# Altium project IRF9540NS IRFZ44 P+N CHAN.PrjPcb
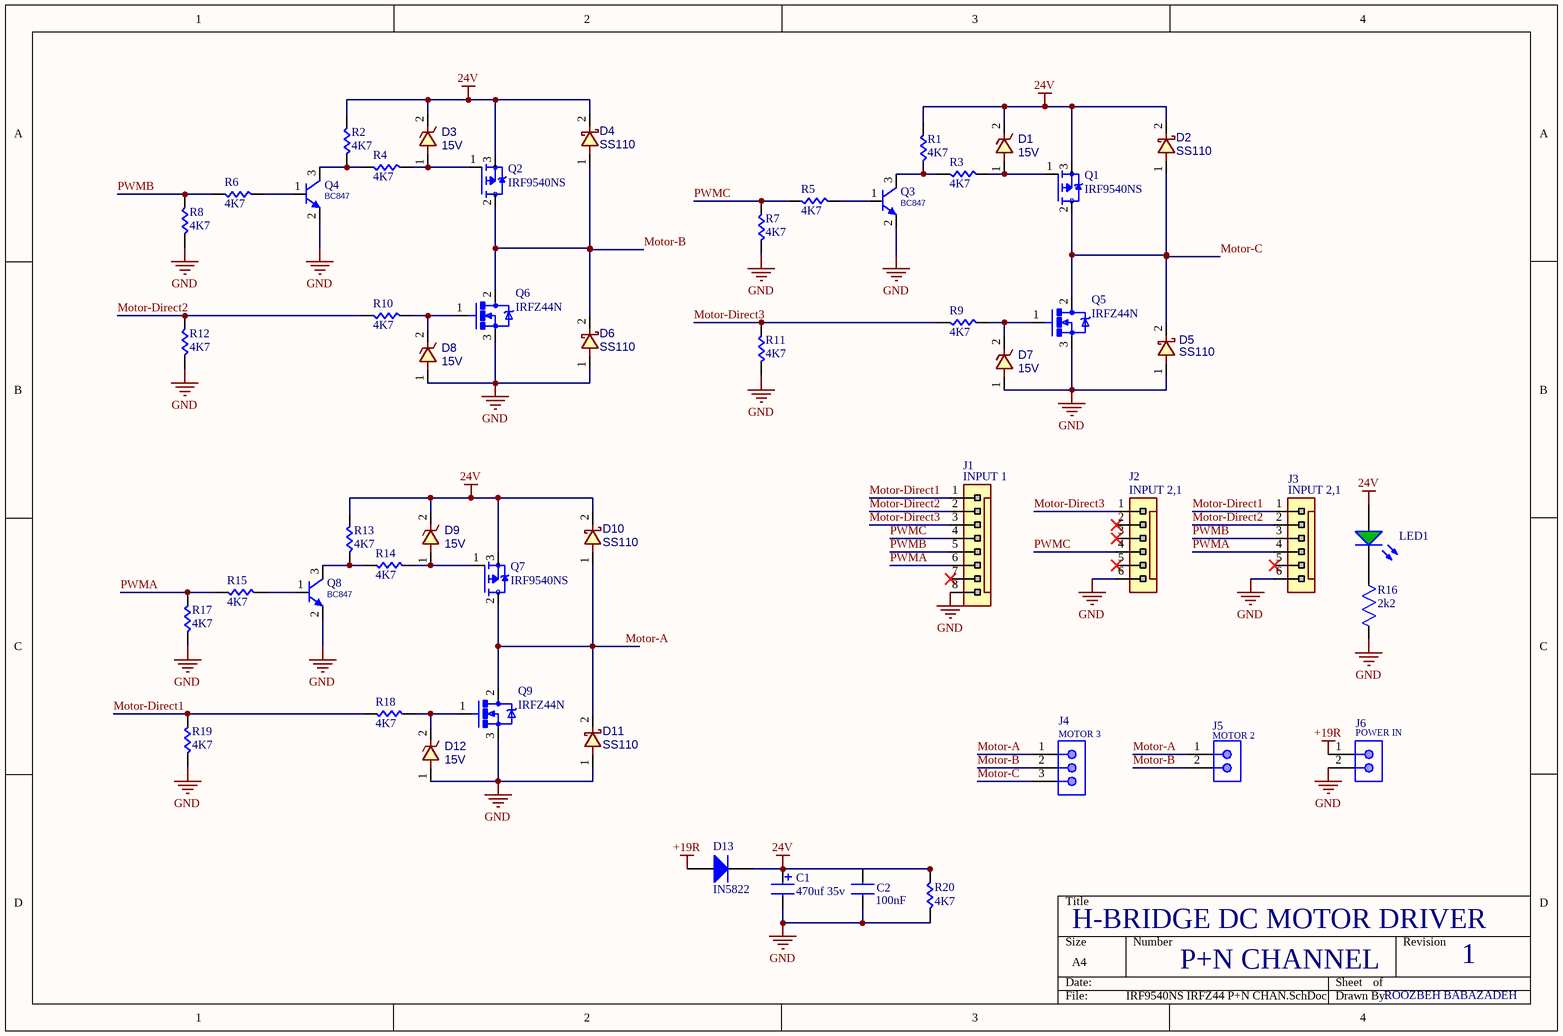
[diagram p0: IRF9540NS IRFZ44 P+N CHAN.SchDoc]
1 sheet, 51 parts. Net scope: global (net labels, ports and power ports of the same name join across sheets).
Board file: IRF9540NS IRFZ44 P+N CHAN.PcbDoc

## Sheet IRF9540NS IRFZ44 P+N CHAN.SchDoc
size A4

### Parts
C1  470uf 35v  [C_EL_10X12]
C2  100nF  [C0805E]
D1  15V  [D_AX02_DO35]
D2  SS110  [D_SMA]
D3  15V  [D_AX02_DO35]
D4  SS110  [D_SMA]
D5  SS110  [D_SMA]
D6  SS110  [D_SMA]
D7  15V  [D_AX02_DO35]
D8  15V  [D_AX02_DO35]
D9  15V  [D_AX02_DO35]
D10  SS110  [D_SMA]
D11  SS110  [D_SMA]
D12  15V  [D_AX02_DO35]
D13  IN5822  [D_AX06_DO27]
J1  INPUT 1  [WF_8]
J2  INPUT 2,1  [WF_6]
J3  INPUT 2,1  [WF_6]
J4  MOTOR 3  [PWL_3]
J5  MOTOR 2  [PWL_2]
J6  POWER IN  [PWL_2]
LED1  (no value)  [LED1206RED]
Q1  IRF9540NS  [DPAK2]
Q2  IRF9540NS  [DPAK2]
Q3  BC847  [SOT23]
Q4  BC847  [SOT23]
Q5  IRFZ44N  [DPAK2]
Q6  IRFZ44N  [DPAK2]
Q7  IRF9540NS  [DPAK2]
Q8  BC847  [SOT23]
Q9  IRFZ44N  [DPAK2]
R1  4K7  [R0805]
R2  4K7  [R0805]
R3  4K7  [R0805]
R4  4K7  [R0805]
R5  4K7  [R0805]
R6  4K7  [R0805]
R7  4K7  [R0805]
R8  4K7  [R0805]
R9  4K7  [R0805]
R10  4K7  [R0805]
R11  4K7  [R0805]
R12  4K7  [R0805]
R13  4K7  [R0805]
R14  4K7  [R0805]
R15  4K7  [R0805]
R16  2k2  [R0805]
R17  4K7  [R0805]
R18  4K7  [R0805]
R19  4K7  [R0805]
R20  4K7  [R0805]

### Nets
24V: C1.1 C2.2 D1.2 D2.2 D3.2 D4.2 D9.2 D10.2 D13.2(K) LED1.1(A) Q1.3 Q2.3 Q7.3 R1.1 R2.1 R13.1 R20.2
+19R: D13.1(A) J6.1
GND: C1.2 C2.1 D5.1 D6.1 D7.1 D8.1 D11.1 D12.1 J1.8 J2.6 J3.6 J6.2 Q3.2(E) Q4.2(E) Q5.3 Q6.3 Q8.2(E) Q9.3 R7.1 R8.1 R11.2 R12.2 R16.2 R17.1 R19.2 R20.1
Motor-A: D10.1 D11.2 J4.1 J5.1 Q7.2 Q9.2
Motor-B: D4.1 D6.2 J4.2 J5.2 Q2.2 Q6.2
Motor-C: D2.1 D5.2 J4.3 Q1.2 Q5.2
Motor-Direct1: J1.1 J3.1 R18.2 R19.1
Motor-Direct2: J1.2 J3.2 R10.2 R12.1
Motor-Direct3: J1.3 J2.1 R9.2 R11.1
PWMA: J1.6 J3.4 R15.1 R17.2
PWMB: J1.5 J3.3 R6.1 R8.2
PWMC: J1.4 J2.4 R5.1 R7.2
NetD1_1: D1.1 Q1.1 R3.1
NetD3_1: D3.1 Q2.1 R4.1
NetD7_2: D7.2 Q5.1 R9.1
NetD8_2: D8.2 Q6.1 R10.1
NetD9_1: D9.1 Q7.1 R14.1
NetD12_2: D12.2 Q9.1 R18.1
NetLED1_2: LED1.2(K) R16.1
NetQ3_1: Q3.1(B) R5.2
NetQ3_3: Q3.3(C) R1.2 R3.2
NetQ4_1: Q4.1(B) R6.2
NetQ4_3: Q4.3(C) R2.2 R4.2
NetQ8_1: Q8.1(B) R15.2
NetQ8_3: Q8.3(C) R13.2 R14.2

Not connected (* = marked no-connect by the designer): J1 7*; J2 2* 3* 5*; J3 5*

### Notes on the sheet
- H-BRIDGE DC MOTOR DRIVER
- P+N CHANNEL
- 1
- ROOZBEH BABAZADEH

### Library data of the parts
C1 = CAP3528
C2 = C
D1 D3 D7-D9 D12 = ZENER: DIODE, ZENER, 3W, 5.6V; MANF: MCC; DESC: DESCRIPTION; PARAM2: 0.5W, 2Ohm, 67mA, -55~150oC; MANF_P#: 3SMAJ5919B-TP; ASSEMBLY: ASSEMBLY; PRICE: 0.5$; PARAM: 5.6V
D2 D4-D6 D10 D11 = SCHOTTKY: DIODE, SCHOTTKY, 40V, 1A; MANF: DIODES; MANF_P#: 1N5819HW-7-F; DESC: DESCRIPTION; ASSEMBLY: ASSEMBLY; PRICE: PRICE; PARAM2: 1A; PARAM: 40V
  D2 D4 D6 D10 D11: VALUE: SS110
D13 = Diode 1N4005: 1 Amp General Purpose Rectifier; Published: 8-Jun-2000; LatestRevisionDate: 17-Jul-2002; LatestRevisionNote: Re-released for DXP Platform.; DatasheetVersion: 1998; PackageVersion: Aug-1999; PackageReference: DO-41; Publisher: Altium Limited; PackageDescription: Diode, Axial; Body 5.2 x 2.7 mm (LxDia. max), Lead Dia. 0.86 mm (max); Code_JEDEC: DO-204-AL; ComponentLink1Description: Manufacturer Link; ComponentLink1URL: http://www.fairchildsemi.com/; ComponentLink2Description: Datasheet; ComponentLink2URL: http://www.fairchildsemi.com/ds/1N%2F1N4001.pdf
J1 = HDRWF_8: Header, WF, Pitch: 2.54mm; VALUE: HDRWF_8
J2 J3 = HDRWF_6: Header, WF, Pitch: 2.54mm; VALUE: HDRWF_6
J4 = sip 3: WR-PHD Pin Header, THT, pitch 2.54mm, Single Row, Vertical, 3pin; Part Number: 61300311121; Pin Number: 3; Gender: Male; Rated Current: 3A; Working Voltage: 250VAC; Withstanding Voltage: 500VAC; Contact Resistance: 20mOhm; ComponentLink1Description: Manufacturer; ComponentLink1URL: http://www.we-online.de; ComponentLink2Description: Datasheet; ComponentLink2URL: https://katalog.we-online.de/em/datasheet/6130xx11121.pdf; Published Date: June 2019; Publisher: Wurth Elektronik; Pitch: 2.54mm; Operating Temperature: -40 to +105degC; Mounting Technology: THT; Packaging: Bag; Row Number: Single; Orientation: Vertical
J5 J6 = sip 2: WR-PHD Pin Header, THT, pitch 2.54mm, Single Row, Vertical, 2pin; Part Number: 61300211121; Pin Number: 2; Gender: Male; Rated Current: 3A; Working Voltage: 250VAC; Withstanding Voltage: 500VAC; Contact Resistance: 20mOhm; ComponentLink1Description: Manufacturer; ComponentLink1URL: http://www.we-online.de; ComponentLink2Description: Datasheet; ComponentLink2URL: https://katalog.we-online.de/em/datasheet/6130xx11121.pdf; Published Date: June 2019; Publisher: Wurth Elektronik; Pitch: 2.54mm; Operating Temperature: -40 to +105degC; Mounting Technology: THT; Packaging: Bag; Row Number: Single; Orientation: Vertical
LED1 = LED3mm
Q1 Q2 Q7 = IRF9540NSTRLPBF: RoHS Compliant | Low RDS_on_ | Industry-leading quality | Dynamic dv/dt Rating | Fast Switching | Fully Avalanche Rated | 175C Operating Temperature | P-Channel MOSFET; MF: Infineon; Availability: Unavailable; SnapEDA_Link: https://www.snapeda.com/parts/IRF9540NSTRLPBF/Infineon%20Technologies/view-part/565416/?ref=snap; MP: IRF9540NSTRLPBF; Price: None; Value: *; Package: D2PAK Infineon
Q3 Q4 Q8 = NPN_BC847_SOT23: BJT, NPN, 45v, 0.1A, SOT23; PARAM: 0.1A, Hfe110~800; PARAM2: 45v, 500mW; MANF: NXP; MANF_P#: BC847; VALUE: BC847
Q5 Q6 Q9 = IRFZ44NPBF: RoHS Compliant | Low RDS_on_ | Industry-leading quality | Dynamic dv/dt Rating | Fast Switching | Fully Avalanche Rated | 175C Operating Temperature; MF: Infineon; MP: IRFZ44NPBF; Price: None; SnapEDA_Link: https://www.snapeda.com/parts/IRFZ44NPBF/Infineon%20Technologies/view-part/1662576/?ref=snap; Package: TO-220 Infineon; Value: *; Availability: Unavailable
R1-R20 = R